# EAGLE schematic LipStick (EAGLE 9.6.2)
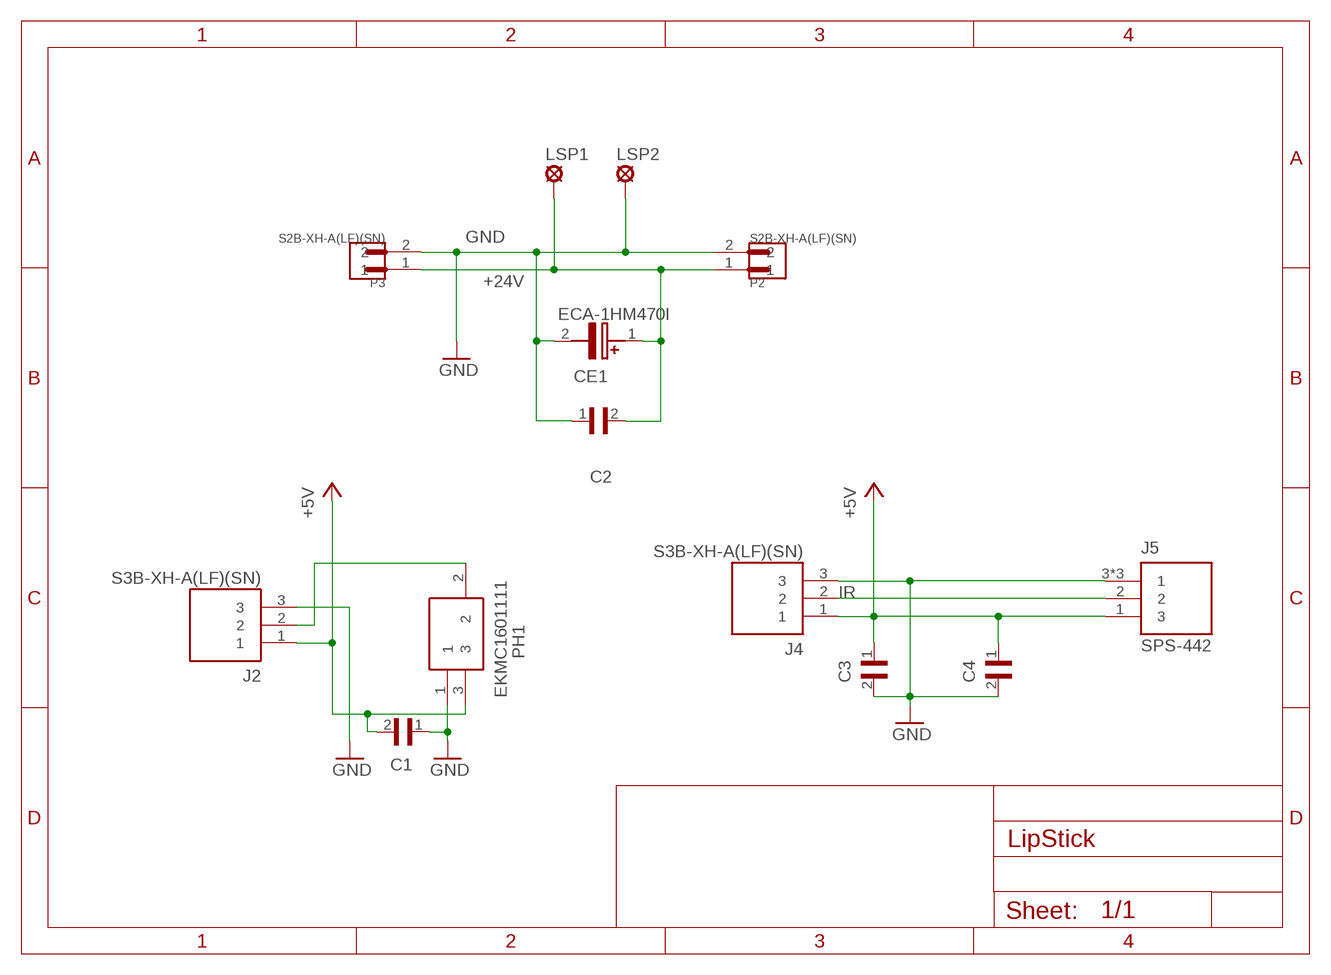
[diagram p0: schematic, sheet 1]

## Parts
C1  GRM188R71H104KA93D  [CAPC1608X90N]
C2  GRM188R71H104KA93D  [CAPC1608X90N]
C3  GRM188R71H104KA93D  [CAPC1608X90N]
C4  GRM188R71H104KA93D  [CAPC1608X90N]
CE1  ECA-1HM470I  [CAPPRD250W55D630H1220]
J2  S3B-XH-A(LF)(SN)  [JST_S3B-XH-A(LF)(SN)]
J4  S3B-XH-A(LF)(SN)  [JST_S3B-XH-A(LF)(SN)]
J5  SPS-442  [SPS-442]
LSP1  SE14  [SE14]
LSP2  SE14  [SE14]
P2  S2B-XH-A(LF)(SN)  [JST_S2B-XH-A(LF)(SN)]
P3  S2B-XH-A(LF)(SN)  [JST_S2B-XH-A(LF)(SN)]
PH1  EKMC1601111  [VZ-STANDARD]

## Nets
+5V: C1.2 C3.1 C4.1 J2.1 J4.1 J5.1 PH1.3
+24V: C2.2 CE1.1(+) LSP1.MP P2.1 P3.1
GND: C1.1 C2.1 C3.2 C4.2 CE1.2(-) J2.3 J4.3 J5.3 J5.4 J5.5 LSP2.MP P2.2 P3.2 PH1.1
IR: J4.2 J5.2
PYRO: J2.2 PH1.2

## Library data of the parts
C1-C4 = GRM188R71H104KA93D:GRM188R71H104KA93D: CERAMIC CAPACITOR, 0.1UF, 50V, X7R, 10%, 0603, FULL REEL Check prices <https://pricing.snapeda.com/parts/GRM188R71H104KA93D/Murata/view-part?ref=eda>; AVAILABILITY: Warning; DESCRIPTION: SMD Capacitor X7R(EIA) with Capacitance: 0.10uF Tol. 10%. Rated Voltage: 50Vdc; MF: Murata; MP: GRM188R71H104KA93D; PACKAGE: 1608 Murata; PRICE: None
CE1 = LED_base:ECA-1HM470I: Panasonic 47uF 50 V Aluminium Electrolytic Capacitor, M Series 2000h 6.3 x 11.2mm Source: Datasheet <http://industrial.panasonic.com/cdbs/www-data/pdf/RDF0000/ABA0000C1218.pdf>; DESCRIPTION: Panasonic 47uF 50 V Aluminium Electrolytic Capacitor, M Series 2000h 6.3 x 11.2mm; HEIGHT: 12.2mm; MANUFACTURER_NAME: Panasonic; MANUFACTURER_PART_NUMBER: ECA-1HM470I; MOUSER_PART_NUMBER: 667-ECA-1HM470I; MOUSER_PRICE-STOCK: https://www.mouser.co.uk/ProductDetail/Panasonic/ECA-1HM470I?qs=rMMd5vBiahqcxSuGyEdILg%3D%3D
J2 J4 = LED_base:S3B-XH-A(LF)(SN): Connector Header Through Hole, Right Angle 3 position 0.098" (2.50mm); DESCRIPTION: Connector Header Through Hole, Right Angle 3 position 0.098 (2.50mm); DIGI-KEY_PART_NUMBER: 455-2250-ND; MF: JST Sales; MP: S3B-XH-A(LF)(SN); PACKAGE: Custom Package JST Sales
J5 = LED_base:SPS-442: Connector Header Through Hole, Right Angle 3 position 0.098" (2.50mm); DESCRIPTION: Connector Header Through Hole, Right Angle 3 position 0.098 (2.50mm); DIGI-KEY_PART_NUMBER: 455-2250-ND; MF: JST Sales; MP: S3B-XH-A(LF)(SN); PACKAGE: Custom Package JST Sales
LSP1 LSP2 = solpad:SE14: SOLDER PAD E1553, drill 1,4mm, distributor Buerklin, 07F820
P2 P3 = LED_base:S2B-XH-A(LF)(SN): XH Series 2.5mm 2 Position Through Hole Shrouded Header Connector Check prices <https://pricing.snapeda.com/parts/S2B-XH-A%28LF%29%28SN%29/JST%20Sales/view-part?ref=eda>; AVAILABILITY: Warning; DESCRIPTION: Connector Header Through Hole, Right Angle 2 position 0.098 (2.50mm); MF: JST Sales; MP: S2B-XH-A(LF)(SN); PACKAGE: None; PRICE: None; PURCHASE-URL: https://pricing.snapeda.com/search/part/S2B-XH-A(LF)(SN)/?ref=eda
PH1 = LED_base:EKMC1601111: Board Mount Motion & Position Sensors Digital 170uA 5m White Source: Datasheet <http://www3.panasonic.biz/ac/e/search_num/index.jsp?c=detail&part_no=EKMC1601111>; ARROW_PART_NUMBER: EKMC1601111; ARROW_PRICE-STOCK: https://www.arrow.com/en/products/ekmc1601111/panasonic; DESCRIPTION: Board Mount Motion & Position Sensors Digital 170uA 5m White; HEIGHT: mm; MANUFACTURER_NAME: Panasonic; MANUFACTURER_PART_NUMBER: EKMC1601111; MOUSER_PART_NUMBER: 769-EKMC1601111; MOUSER_PRICE-STOCK: https://www.mouser.co.uk/ProductDetail/Panasonic-Industrial-Devices/EKMC1601111?qs=raAh8RbVwI6ED3w29KeQNg%3D%3D